# Altium schematic sheet gnss_quectel_lc29hea.SchDoc
size A
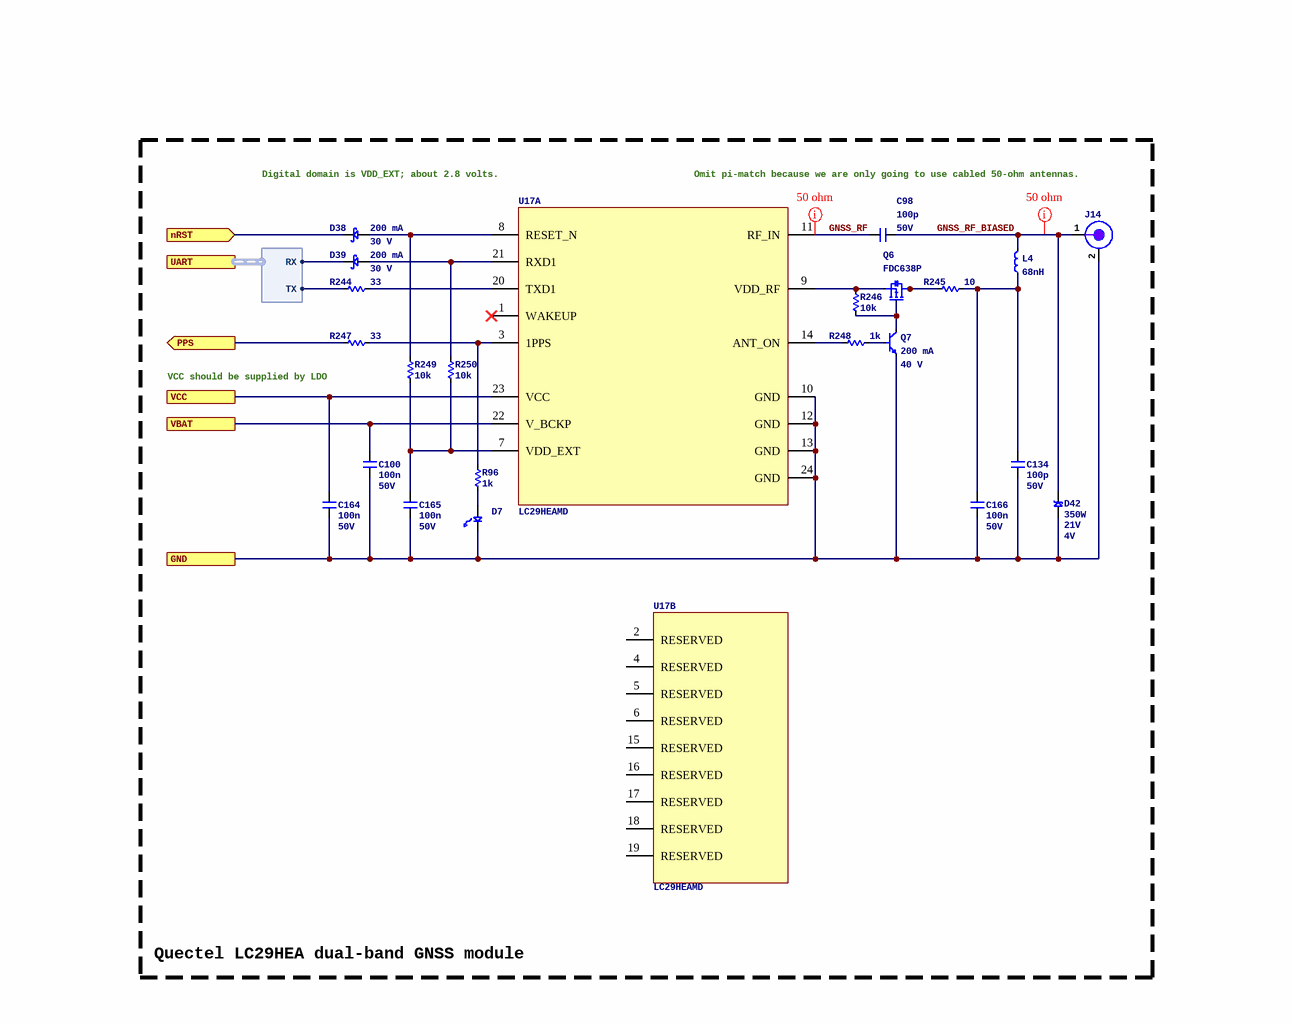
[diagram p0: gnss_quectel_lc29hea.SchDoc]

## Parts
C98  Capacitance: 100p  Voltage Rating: 50V  [C0402]  (hidden comment: 0402CG101J500NT)
C100  Capacitance: 100n  Voltage Rating: 50V  [C0402]  (hidden comment: CL05B104KB54PNC)
C134  Capacitance: 100p  Voltage Rating: 50V  [C0402]  (hidden comment: 0402CG101J500NT)
C164  Capacitance: 100n  Voltage Rating: 50V  [C0402]  (hidden comment: CL05B104KB54PNC)
C165  Capacitance: 100n  Voltage Rating: 50V  [C0402]  (hidden comment: CL05B104KB54PNC)
C166  Capacitance: 100n  Voltage Rating: 50V  [C0402]  (hidden comment: CL05B104KB54PNC)
D7  LTST-C191TBKT  [LED_0603P_BLUE]  (value not drawn)
D38  Current: 200 mA  Voltage: 30 V  [SOD523]  (hidden comment: BAT54XV2T1G)
D39  Current: 200 mA  Voltage: 30 V  [SOD523]  (hidden comment: BAT54XV2T1G)
D42  Non-rep Peak Rev Power Dis-Max: 350W  Clamping Voltage-Max: 21V  Min Breakdown Voltage: 4V  [SOD323]  (hidden comment: PTVSLC3D3V3B)
J14  RFPC-SMA14-FN-A  [GCT_RFPC-SMA14-FN-A]  (value not drawn)
L4  value 68nH  [L0603_0.95MM]  (hidden comment: LQW18AN68NJ80D)
Q6  FDC638P  [6SOT23]
Q7  Current: 200 mA  Voltage: 40 V  [3SOT523]  (hidden comment: MMBT3904T)
R96  value 1k  [R0402]  (hidden comment: 0402WGF1001TCE)
R244  value 33  [R0402]  (hidden comment: 0402WGF330JTCE)
R245  value 10  [R2512]  (hidden comment: RTT2510R0FTE)
R246  value 10k  [R0402]  (hidden comment: 0402WGF1002TCE)
R247  value 33  [R0402]  (hidden comment: 0402WGF330JTCE)
R248  value 1k  [R0402]  (hidden comment: 0402WGF1001TCE)
R249  value 10k  [R0402]  (hidden comment: 0402WGF1002TCE)
R250  value 10k  [R0402]  (hidden comment: 0402WGF1002TCE)
U17  LC29HEAMD  [QUECTEL_LC29H]  (parts A,B of 2)

## Ports
GND, nRST (in), PPS (out), UART (harness UART), VBAT, VCC

## Harnesses
UART: RX, TX

## Nets
GND: C100.2 C134.2 C164.2 C165.2 C166.2 D7.1 D42.1 J14.2(GND) Q7.2(E) U17.10(GND) U17.12(GND) U17.13(GND) U17.24(GND) ; port GND
GNSS_RF: C98.1 U17.11(RF_IN)
GNSS_RF_BIASED: C98.2 D42.2 J14.1(RF) L4.2
nRST: D38.2 ; port nRST
PPS: R247.2 ; port PPS
VBAT: C100.1 U17.22(V_BCKP) ; port VBAT
VCC: C164.1 U17.23(VCC) ; port VCC
NetC134_1: C134.1 C166.1 L4.1 R245.1
NetC165_1: C165.1 R249.2 R250.2 U17.7(VDD_EXT)
NetD7_2: D7.2 R96.2
NetD38_1: D38.1 R249.1 U17.8(RESET_N)
NetD39_1: D39.1 R250.1 U17.21(RXD1)
NetD39_2: D39.2 ; port UART.RX
NetQ6_1: Q6.1 Q6.2 Q6.5 Q6.6 R245.2
NetQ6_3: Q6.3 Q7.3(C) R246.2
NetQ6_4: Q6.4 R246.1 U17.9(VDD_RF)
NetQ7_1: Q7.1(B) R248.1
NetR96_1: R96.1 R247.1 U17.3(1PPS)
NetR244_1: R244.1 U17.20(TXD1)
NetR244_2: R244.2 ; port UART.TX
NetR248_2: R248.2 U17.14(ANT_ON)

Not connected (* = marked no-connect by the designer): U17 1(WAKEUP)* 2(RESERVED) 4(RESERVED) 5(RESERVED) 6(RESERVED) 15(RESERVED) 16(RESERVED) 17(RESERVED) 18(RESERVED) 19(RESERVED)

## Layout directives
net class SE_50: GNSS_RF, GNSS_RF_BIASED

## Notes on the sheet
- Digital domain is VDD_EXT; about 2.8 volts.
- Omit pi-match because we are only going to use cabled 50-ohm antennas.
- (near R247) VCC should be supplied by LDO
- Quectel LC29HEA dual-band GNSS module

## Library data of the parts
C98 C134 = 0402CG101J500NT: Manufacturer: FH(Guangdong Fenghua Advanced Tech); Dielectric: C0G; ComponentLink1URL: https://wmsc.lcsc.com/wmsc/upload/file/pdf/v2/lcsc/2304140030_FH--Guangdong-Fenghua-Advanced-Tech-0402CG101J500NT_C1546.pdf; ComponentLink1Description: Datasheet; Manufacturer Part Number: 0402CG101J500NT; Package: 0402; Supplier 2: LCSC; Supplier Part Number 2: C1546
C100 C164-C166 = CL05B104KB54PNC: Manufacturer: Samsung Electro-Mechanics; Dielectric: X7R; ComponentLink1URL: https://wmsc.lcsc.com/wmsc/upload/file/pdf/v2/lcsc/2304140030_Samsung-Electro-Mechanics-CL05B104KB54PNC_C307331.pdf; ComponentLink1Description: Datasheet; Manufacturer Part Number: CL05B104KB54PNC; Package: 0402; Supplier 2: LCSC; Supplier Part Number 2: C307331
D7 = LED_0603_BLUE_LTST-C191TBKT: LED 468NM BLUE CLEAR 0603 SMD; Manufacturer: Lite-On Inc; Supplier 1: Digikey; Manufacturer Part Number: LTST-C191TBKT; ComponentLink1URL: https://mm.digikey.com/Volume0/opasdata/d220001/medias/docus/1139/LTST-C190AKT.pdf; ComponentLink1Description: Datasheet; Supplier Part Number 1: 160-1647-1-ND; Supplier 2: LCSC; Supplier Part Number 2: C99290
D38 D39 = SCHOTTKY_30V_BAT54XV2T1G: ON Semi BAT54XV2T1G; SMT Schottky Diode; 30V 200mA; 5ns; 2-Pin SOD-523; Manufacturer: onsemi; Supplier 1: DigiKey; Supplier Part Number 1: BAT54XV2T1GOSCT-ND; Manufacturer Part Number: BAT54XV2T1G; Supplier 2: LCSC; Supplier Part Number 2: C81572; ComponentLink1Description: Datasheet; ComponentLink1URL: https://www.onsemi.com/pdf/datasheet/bat54xv2t1-d.pdf
D42 = TVS_UNI_3.3V_PTVSLC3D3V3B: -55℃~+150℃ 1uA 20A@8/20us 21V 3.3V 3.5pF 350W@8/20us 4V Bidirectional IEC 61000-4-2 TVS SOD-323 ESD and Surge Protection (TVS/ESD) ROHS; Manufacturer: Prisemi; Supplier 1: LCSC; Supplier Part Number 1: C246774; Manufacturer Part Number: PTVSLC3D3V3B; ComponentLink1URL: https://mm.digikey.com/Volume0/opasdata/d220001/medias/docus/4180/30KPA_Series.pdf; ComponentLink1Description: Datasheet
J14 = CONN_GCT_SMA_RA_RFPC-SMA14-FN-A: SMA Connector Jack, Female Socket Panel Mount, Through Hole, Right Angle Solder, IP68 unmated; Manufacturer: GCT (Gradconn); Supplier 1: Digikey; Supplier Part Number 1: 2072-RFPC-SMA14-FN-A-ND; Manufacturer Part Number: RFPC-SMA14-FN-A; ComponentLink1Description: Datasheet; ComponentLink1URL: https://www.gradconn.com/Files/Drawings/RFPC-SMA14-FN.pdf; Supplier 2: LCSC; Supplier Part Number 2: C3173272
L4 = IND_0.068UH_LQW18AN68NJ80D: General Purpose Inductor, 0.068uH, 5%, 1 Element, Wirewound-Core, 1608/0603, 2.38GHz self resonant frequency; Manufacturer: Murata; Current: 630mA; Supplier 1: Digikey; Supplier Part Number 1: LQW18AN68NJ80D-ND; Manufacturer Part Number: LQW18AN68NJ80D; Supplier 2: LCSC; Supplier Part Number 2: C269832
Q6 = PFET_20V_FDC638P: MOSFET P-CH 20V 4.5A SSOT-6; Manufacturer: onsemi; Supplier 1: Digikey; ComponentLink1URL: https://www.onsemi.com/pdf/datasheet/fdc638p-d.pdf; ComponentLink1Description: Datasheet; Supplier Part Number 1: FDC638PCT-ND; Manufacturer Part Number: FDC638P; Supplier 2: LCSC; Supplier Part Number 2: C241772
Q7 = NPN_40V_MMBT3904T: Bipolar (BJT) Transistor NPN 40 V 200 mA 300MHz 150 mW Surface Mount SOT-523; Manufacturer: Shenzhen Slkormicro Semicon Co., Ltd.; Supplier 1: Digikey; Supplier Part Number 1: 5399-MMBT3904TCT-ND; Manufacturer Part Number: MMBT3904T; ComponentLink1Description: Datasheet; ComponentLink1URL: https://mm.digikey.com/Volume0/opasdata/d220001/medias/docus/7136/5399_MMBT3904T%20SOT-523.pdf; Supplier 2: LCSC; Supplier Part Number 2: C61616
R96 R248 = 0402WGF1001TCE: Manufacturer: UNI-ROYAL(Uniroyal Elec); Tolerance: 1%; Temperature Coefficient: Â±100ppm/â„ƒ; Power Rating (mW): 62.5; ComponentLink1Description: Datasheet; ComponentLink1URL: https://wmsc.lcsc.com/wmsc/upload/file/pdf/v2/lcsc/2206010216_UNI-ROYAL-Uniroyal-Elec-0402WGF1001TCE_C11702.pdf; Manufacturer Part Number: 0402WGF1001TCE; Package: 0402; Supplier 2: LCSC; Supplier Part Number 2: C11702
R244 R247 = 0402WGF330JTCE: Manufacturer: UNI-ROYAL(Uniroyal Elec); Tolerance: 1%; Temperature Coefficient: Â±100ppm/â„ƒ; Power Rating (mW): 62.5; ComponentLink1Description: Datasheet; ComponentLink1URL: https://wmsc.lcsc.com/wmsc/upload/file/pdf/v2/lcsc/2205311900_UNI-ROYAL-Uniroyal-Elec-0402WGF330JTCE_C25105.pdf; Manufacturer Part Number: 0402WGF330JTCE; Package: 0402; Supplier 2: LCSC; Supplier Part Number 2: C25105
R245 = RTT2510R0FTE: Manufacturer: RALEC; Tolerance: 1%; Temperature Coefficient: Â±100ppm/â„ƒ; Power Rating (mW): 1000; ComponentLink1Description: Datasheet; ComponentLink1URL: https://wmsc.lcsc.com/wmsc/upload/file/pdf/v2/lcsc/2304140030_RALEC-RTT2510R0FTE_C105071.pdf; Manufacturer Part Number: RTT2510R0FTE; Package: 2512; Supplier 2: LCSC; Supplier Part Number 2: C105071
R246 R249 R250 = 0402WGF1002TCE: Manufacturer: UNI-ROYAL(Uniroyal Elec); Tolerance: 1%; Temperature Coefficient: Â±100ppm/â„ƒ; Power Rating (mW): 62.5; ComponentLink1Description: Datasheet; ComponentLink1URL: https://wmsc.lcsc.com/wmsc/upload/file/pdf/v2/lcsc/2206010100_UNI-ROYAL-Uniroyal-Elec-0402WGF1002TCE_C25744.pdf; Manufacturer Part Number: 0402WGF1002TCE; Package: 0402; Supplier 2: LCSC; Supplier Part Number 2: C25744
U17 = GNSS_QUECTEL_LC29HEAMD: Rf Txrx Module Navigation SMD; Supplier: DigiKey; Supplier Part Number: 2958-LC29HEAMDCT-ND; Manufacturer: Quectel; Manufacturer Part Number: LC29HEAMD; Category: RF Transceiver Modules and Modems; Stock: 95; Pricing: 1=41.12, 10=35.985, 25=34.2064, 100=31.769 (USD)